# Altium schematic sheet LPSP_N5V0.SchDoc
size A3; Organization: Canis Tech; Address1: -; Address2: -; Address3: -; Address4: Indaiatuba/SP; Address5: Brazil
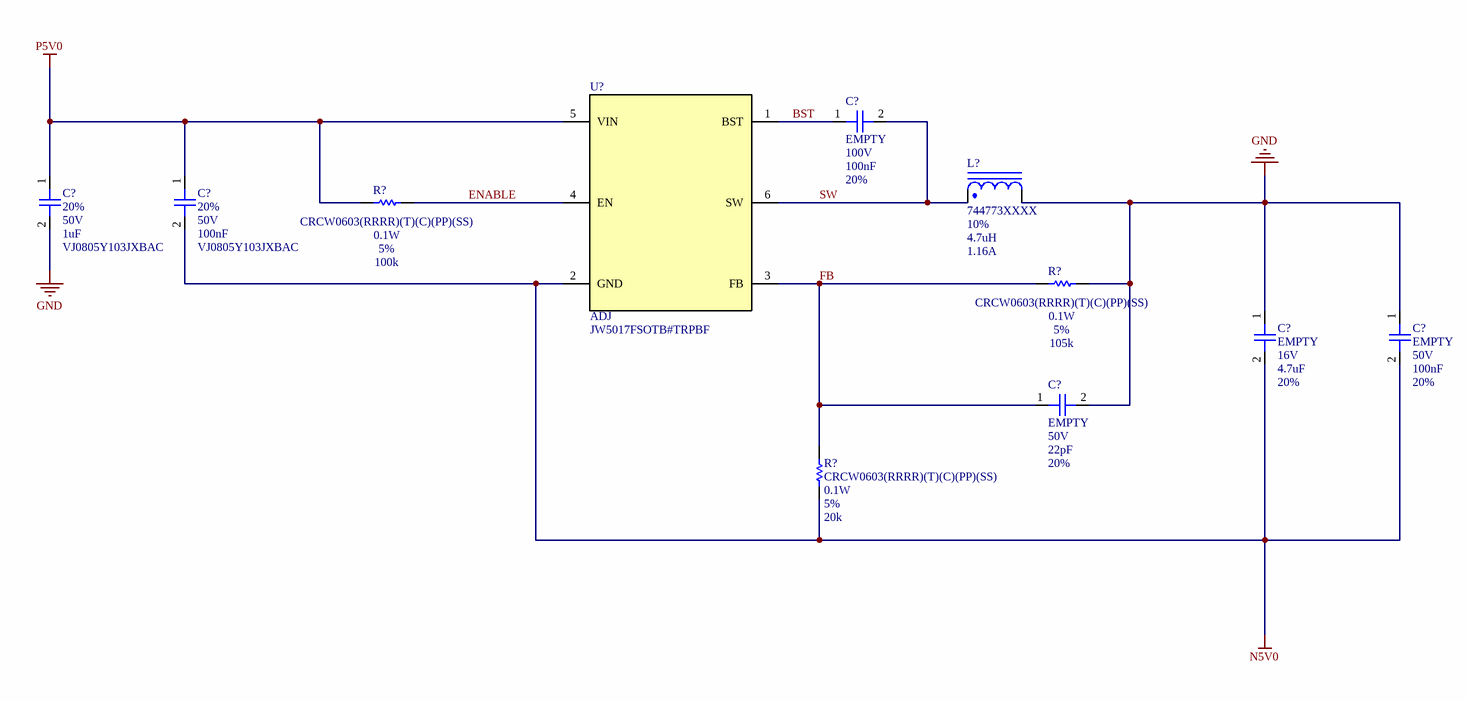
[diagram p0: LPSP_N5V0.SchDoc]

## Parts
(Parts that share a designator on the sheet are numbered #1, #2 ... from top to bottom, then left to right.)
C?#1  value 100nF  PartNumber1: EMPTY  Voltage: 100V  Tolerance: 20%  [CAP0603]  (hidden comment: CC0603)
C?#2  value 1uF  Tolerance: 20%  Voltage: 50V  PartNumber1: VJ0805Y103JXBAC  [CAP0805]  (hidden comment: VJ Series)
C?#3  value 100nF  Tolerance: 20%  Voltage: 50V  PartNumber1: VJ0805Y103JXBAC  [CAP0805]  (hidden comment: VJ Series)
C?#4  value 4.7uF  PartNumber1: EMPTY  Voltage: 16V  Tolerance: 20%  [CAP0603]  (hidden comment: CC0603)
C?#5  value 100nF  PartNumber1: EMPTY  Voltage: 50V  Tolerance: 20%  [CAP0603]  (hidden comment: CC0603)
C?#6  value 22pF  PartNumber1: EMPTY  Voltage: 50V  Tolerance: 20%  [CAP0603]  (hidden comment: CC0603)
L?  value 4.7uH  PartNumber1: 744773XXXX  Tolerance: 10%  Current: 1.16A  [WE-PD2-3521]  (hidden comment: WE-PD2 3521)
R?#1  value 100k  PartNumber1: CRCW0603(RRRR)(T)(C)(PP)(SS)  Power: 0.1W  Tolerance: 5%  [RES0603]  (hidden comment: Chip Resistor)
R?#2  value 105k  PartNumber1: CRCW0603(RRRR)(T)(C)(PP)(SS)  Power: 0.1W  Tolerance: 5%  [RES0603]  (hidden comment: Chip Resistor)
R?#3  value 20k  PartNumber1: CRCW0603(RRRR)(T)(C)(PP)(SS)  Power: 0.1W  Tolerance: 5%  [RES0603]  (hidden comment: Chip Resistor)
U?  Voltage: ADJ  PartNumber1: JW5017FSOTB#TRPBF  [SOT-23-6]  (hidden comment: JW5017F)

## Nets
GND: C?#2.2 C?#4.1 C?#5.1 C?#6.2 L?.2 R?#2.2
N5V0: C?#3.2 C?#4.2 C?#5.2 R?#3.2 U?.2(GND)
P5V0: C?#2.1 C?#3.1 R?#1.2 U?.5(VIN)
BST: C?#1.1 U?.1(BST)
ENABLE: R?#1.1 U?.4(EN)
FB: C?#6.1 R?#2.1 R?#3.1 U?.3(FB)
SW: C?#1.2 L?.1 U?.6(SW)

## Notes on the sheet
- Title
- Author
- Checked By
- Variant
- Size:
- Revision:
- A3
- Date:
- Project
- Time:
- Sheet
- of
- File:

## Library data of the parts
C?#1 C?#4-C?#6 = CC0603: Surface Mount Multilayer Ceramic Chip Capacitors  for Commercial Applications; Manufacturer1: Yageo; Published: 19-Jun-2016; LatestRevisionDate: 19-Jun-2016; Publisher: Lucas Moraes; PackageReference: CAP0603; PackageDescription: CAP0603;2 Leads
C?#2 C?#3 = VJ0805: Surface Mount Multilayer Ceramic Chip Capacitors  for Commercial Applications; Manufacturer1: Vishay; Published: 19-Jun-2016; LatestRevisionDate: 19-Jun-2016; Publisher: Lucas Moraes; PackageReference: CAP0805; PackageDescription: CAP0805;2 Leads; Datasheet: http://www.mouser.com/ds/2/427/vjcommercialseries-222796.pdf
L? = WE-PD2 3521: Fixed Inductors WE-PD2 3521; Manufacturer1: Wurth Elektronik; LatestRevisionDate: 22-Mar-2022; PackageReference: WE-PD2 3521; Publisher: Lucas Moraes; PackageDescription: WE-PD2 3521; 2 Leads; Published: 22-Mar-2022; Datasheet: https://www.we-online.com/catalog/en/WE-PD2
R?#1-R?#3 = CRCW0603: Thick Film Chip Resistors with CECC Approval,  available with Established Reliability; Manufacturer1: Vishay; LatestRevisionDate: 06-May-2016; PackageReference: 0603; Publisher: Lucas Moraes; PackageDescription: SMD 0603; 2 Leads; Published: 06-May-2016
U? = JW5017F: 1.2A, 26V Synchronous Step-Down Converter; Manufacturer1: JOULWATT; Current: 1.2A; LatestRevisionDate: 08-Jan-2022; LatestRevisionNote: Created; PackageDescription: SOT-23-6;6 Leads; PackageReference: SOT-23-6; Published: 08-Jan-2022; Publisher: Lucas Moraes